# Altium schematic sheet sstate_relay_discharge.SchDoc
size A4
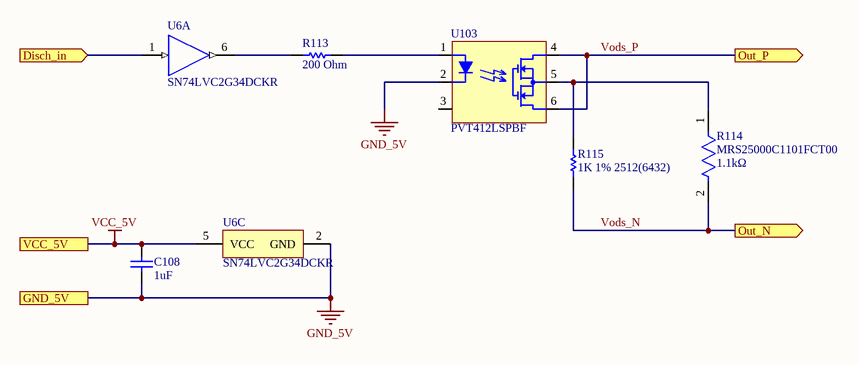
[diagram p0: sstate_relay_discharge.SchDoc]

## Parts
C108  value 1uF  [CAPC0603(1608)100_N]  (hidden comment: CAP 1uF 50V 0603(1608))
R113  value 200 Ohm  [RESC2013X60X40NL20T25]  (hidden comment: ERA6AEB201V)
R114  MRS25000C1101FCT00  value 1.1kΩ  [FP-MRS25-MFG]
R115  1K 1% 2512(6432)  [RESC2512(6432)_M]
U6  SN74LVC2G34DCKR  [DCK0006A_L]  (parts A,C of 3)
U103  PVT412LSPBF  [SOP254P980X318-6M-PVT412LSPBF]

## Ports
Disch_in (in), GND_5V, Out_N (out), Out_P (out), VCC_5V

## Nets
GND_5V: C108.1 U6.2(GND) U103.2 ; port GND_5V
VCC_5V: C108.2 U6.5(VCC) ; port VCC_5V
Disch_in: U6.1(1A) ; port Disch_in
Vods_N: R114.2 R115.1 ; port Out_N
Vods_P: U103.4 U103.6 ; port Out_P
NetR113_1: R113.1 U6.6(1Y)
NetR113_2: R113.2 U103.1
NetR114_1: R114.1 R115.2 U103.5

Not connected (* = marked no-connect by the designer): U103 3

## Library data of the parts
C108 = CMP-1035-02746-1: CAP 1uF 50V ±20% 0603 (1608 Metric) Thickness 1mm SMD; Tolerance: Â±20%; Case-EIA: 0603; Case-Metric: 1608; Technology: SMT; Max Thickness: 1 mm; Rated Voltage: 50 V
R113 = CMP-2001-00608-1: Manufacturer: Panasonic; Part Number: ERA6AEB201V; Package: 0805
R114 = CMP-02408-000003-1: RES 1.1K OHM 0.6W 1% AXIAL; Manufacturer: Vishay BC Components; Voltage Rating: 350V; Temperature Coefficient: 50ppm/°C; Device Class L1: Passive Components; Height: 2.5mm; Octopart: https://octopart.com/mrs25000c1101fct00-vishay-43740214; Temperature Range Low: -55°C; Temperature: -55°C to +155°C; Temperature Range High: +155°C; Lead Free: Yes; Mouser Description: Thin Film Resistors .6watt 1.1Kohms 1%; Power Rating: 0.6W; Digikey Description: RES 1.1K OHM 0.6W 1% AXIAL; RoHS: TRUE; Tolerance: 1%; Package: MRS25; Device Class L3: Through-Hole Resistors; ComponentLink2URL: http://www.vishay.com/docs/28724/mrs16m25.pdf; ComponentLink2Description: Datasheet; Resistance: 1.1kΩ; Composition: Thin Film; Automotive: No; Ipc Land Pattern Name: RESAD1000W75L650D250; Device Class L2: Resistors; Category: Res; Series: MRS25; Manufacturer Part Number: MRS25000C1101FCT00
R115 = CMP-1018-00510-1: 1K 1W 1% 2512 (6432 Metric)  SMD; Case-EIA: 2512; Case-Metric: 6432; Value: 1000.00 Ohm; Technology: SMT; Tolerance: 1 %; Power: 1 W
U6 = CMP-0859-00474-3: Dual Buffer Gate, DCK0006A, LARGE T&R; Manufacturer: Texas Instruments; Voltage(Nom)(V): 1.8,2.5,3.3,5; Schmitt Trigger: No; Rating: Catalog; Output Type: CMOS; F @ Nom Voltage(Max)(Mhz): 150; Output Drive (IOL/IOH)(Max)(mA): 32/-32; Sub-Family: Non-Inverting Buffer/Driver; Technology Family: LVC; Input Type: CMOS/TTL; ICC @ Nom Voltage(Max)(mA): 0.01; VCC(Min)(V): 1.65; Bits(#): 2; Logic: True; tpd @ Nom Voltage(Max)(ns): 8.6,4.4,4.1,3.2; VCC(Max)(V): 5.5; 3-State Output: No; Operating Temperature Range(C): -40 to 125,-40 to 85; DatasheetVersion: SCES359I; PackageReference: DCK0006A; Generic Part Number: SN74LVC2G34
U103 = PVT412LSPBF: IC RELAY PHOTOVO 400V 120MA 6SMD; Manufacturer: International Rectifier; Max Input Current: 25mA; Throw Configuration: SPST,SP; Isolation Voltage: 4kV; On-State Resistance: 35R; Turn-On Delay Time: 2ms; Approvals: UL; Manufacturer Part Number: PVT412LSPBF; RoHS: Yes; Category: Solid State Relays; Stock 1: 335; Pricing 1: 1=3,23000, 10=3,03100, 25=2,69480, 50=2,55980, 100=2,42510, 250=2,15568, 500=2,02096, 1000=1,88622, 5000=1,81886 (USD); Mount: Surface Mount; Case/Package: SMD/SMT; Number of Pins: 6; Min Operating Temperature: -40°C; Max Operating Temperature: 85°C; Max Output Voltage: 400V; Packaging: Rail/Tube; Input Current: 25mA; Load Current: 120mA; Termination: Gull Wing; Output Current: 120mA; Package Quantity: 50; Relay Type: Relay; Output Voltage: 400V; Length: 8.63mm; Height: 3.42mm; Depth: 6.47mm; Radiation Hardening: No; Lead Free: Lead Free; ComponentLink1URL: https://datasheet.ciiva.com/15141/getdatasheetpartid-385077-15141601.pdf?src-supplier=Verical; ComponentLink1Description: https://datasheet.ciiva.com/15141/getdatasheetpartid-385077-15141601.pdf?src-supplier=Verical; ComponentLink2URL: https://datasheet.ciiva.com/26924/pvt412lspbf-26924616.pdf?src-supplier=IIIC; ComponentLink2Description: https://datasheet.ciiva.com/26924/pvt412lspbf-26924616.pdf?src-supplier=IIIC; ComponentLink3URL: https://datasheet.ciiva.com/17305/pvt412-17305893.pdf?src-supplier=Avnet+Europe; ComponentLink3Description: https://datasheet.ciiva.com/17305/pvt412-17305893.pdf?src-supplier=Avnet+Europe; ComponentLink4URL: https://datasheet.ciiva.com/2421/pvt412-2421789.pdf?src-supplier=Digi-Key; ComponentLink4Description: https://datasheet.ciiva.com/2421/pvt412-2421789.pdf?src-supplier=Digi-Key; Supplier 1: Digi-Key; Supplier 2: Arrow; Supplier 3: Avnet; Supplier 4: Mouser; Supplier 5: Farnell; Supplier Part Number 5: 2762281; Supplier Part Number 4: 942-PVT412LSPBF; Supplier Part Number 3: PVT412LSPBF; Supplier Part Number 2: PVT412LSPBF; Supplier Part Number 1: PVT412LSPBF-ND